# EAGLE schematic headstage (EAGLE 6.6.0)
DESIGNER: JONNEW, MWL@MIT; DESIGN_NAME: headstage (2x64_hirose-circular); LICENSE: (c) Jon Newman CC-BY-SA-NC 4.0; REVISION: 1.1
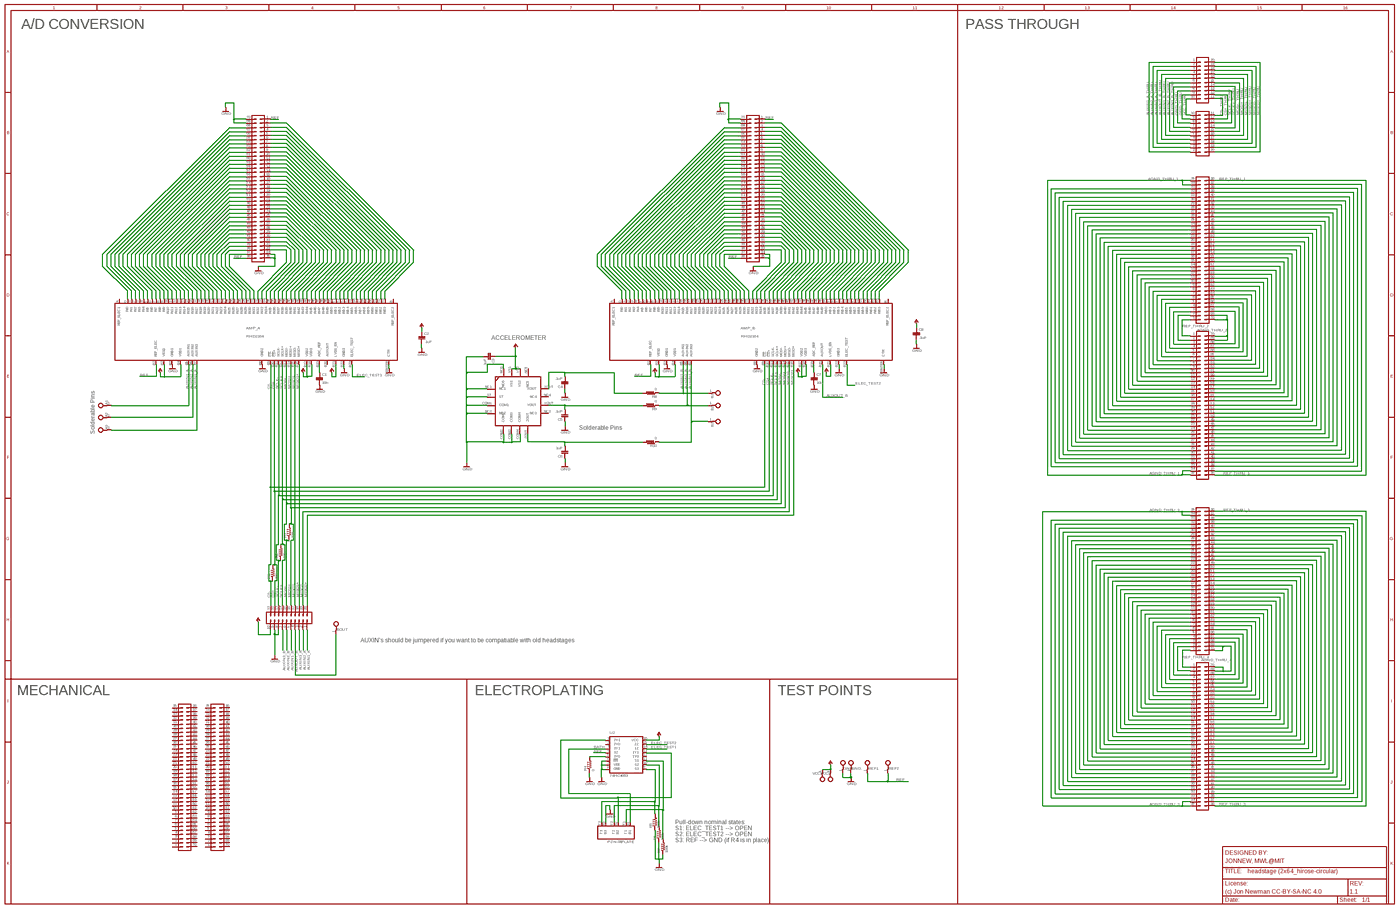
[diagram p0: schematic, sheet 1, overview]
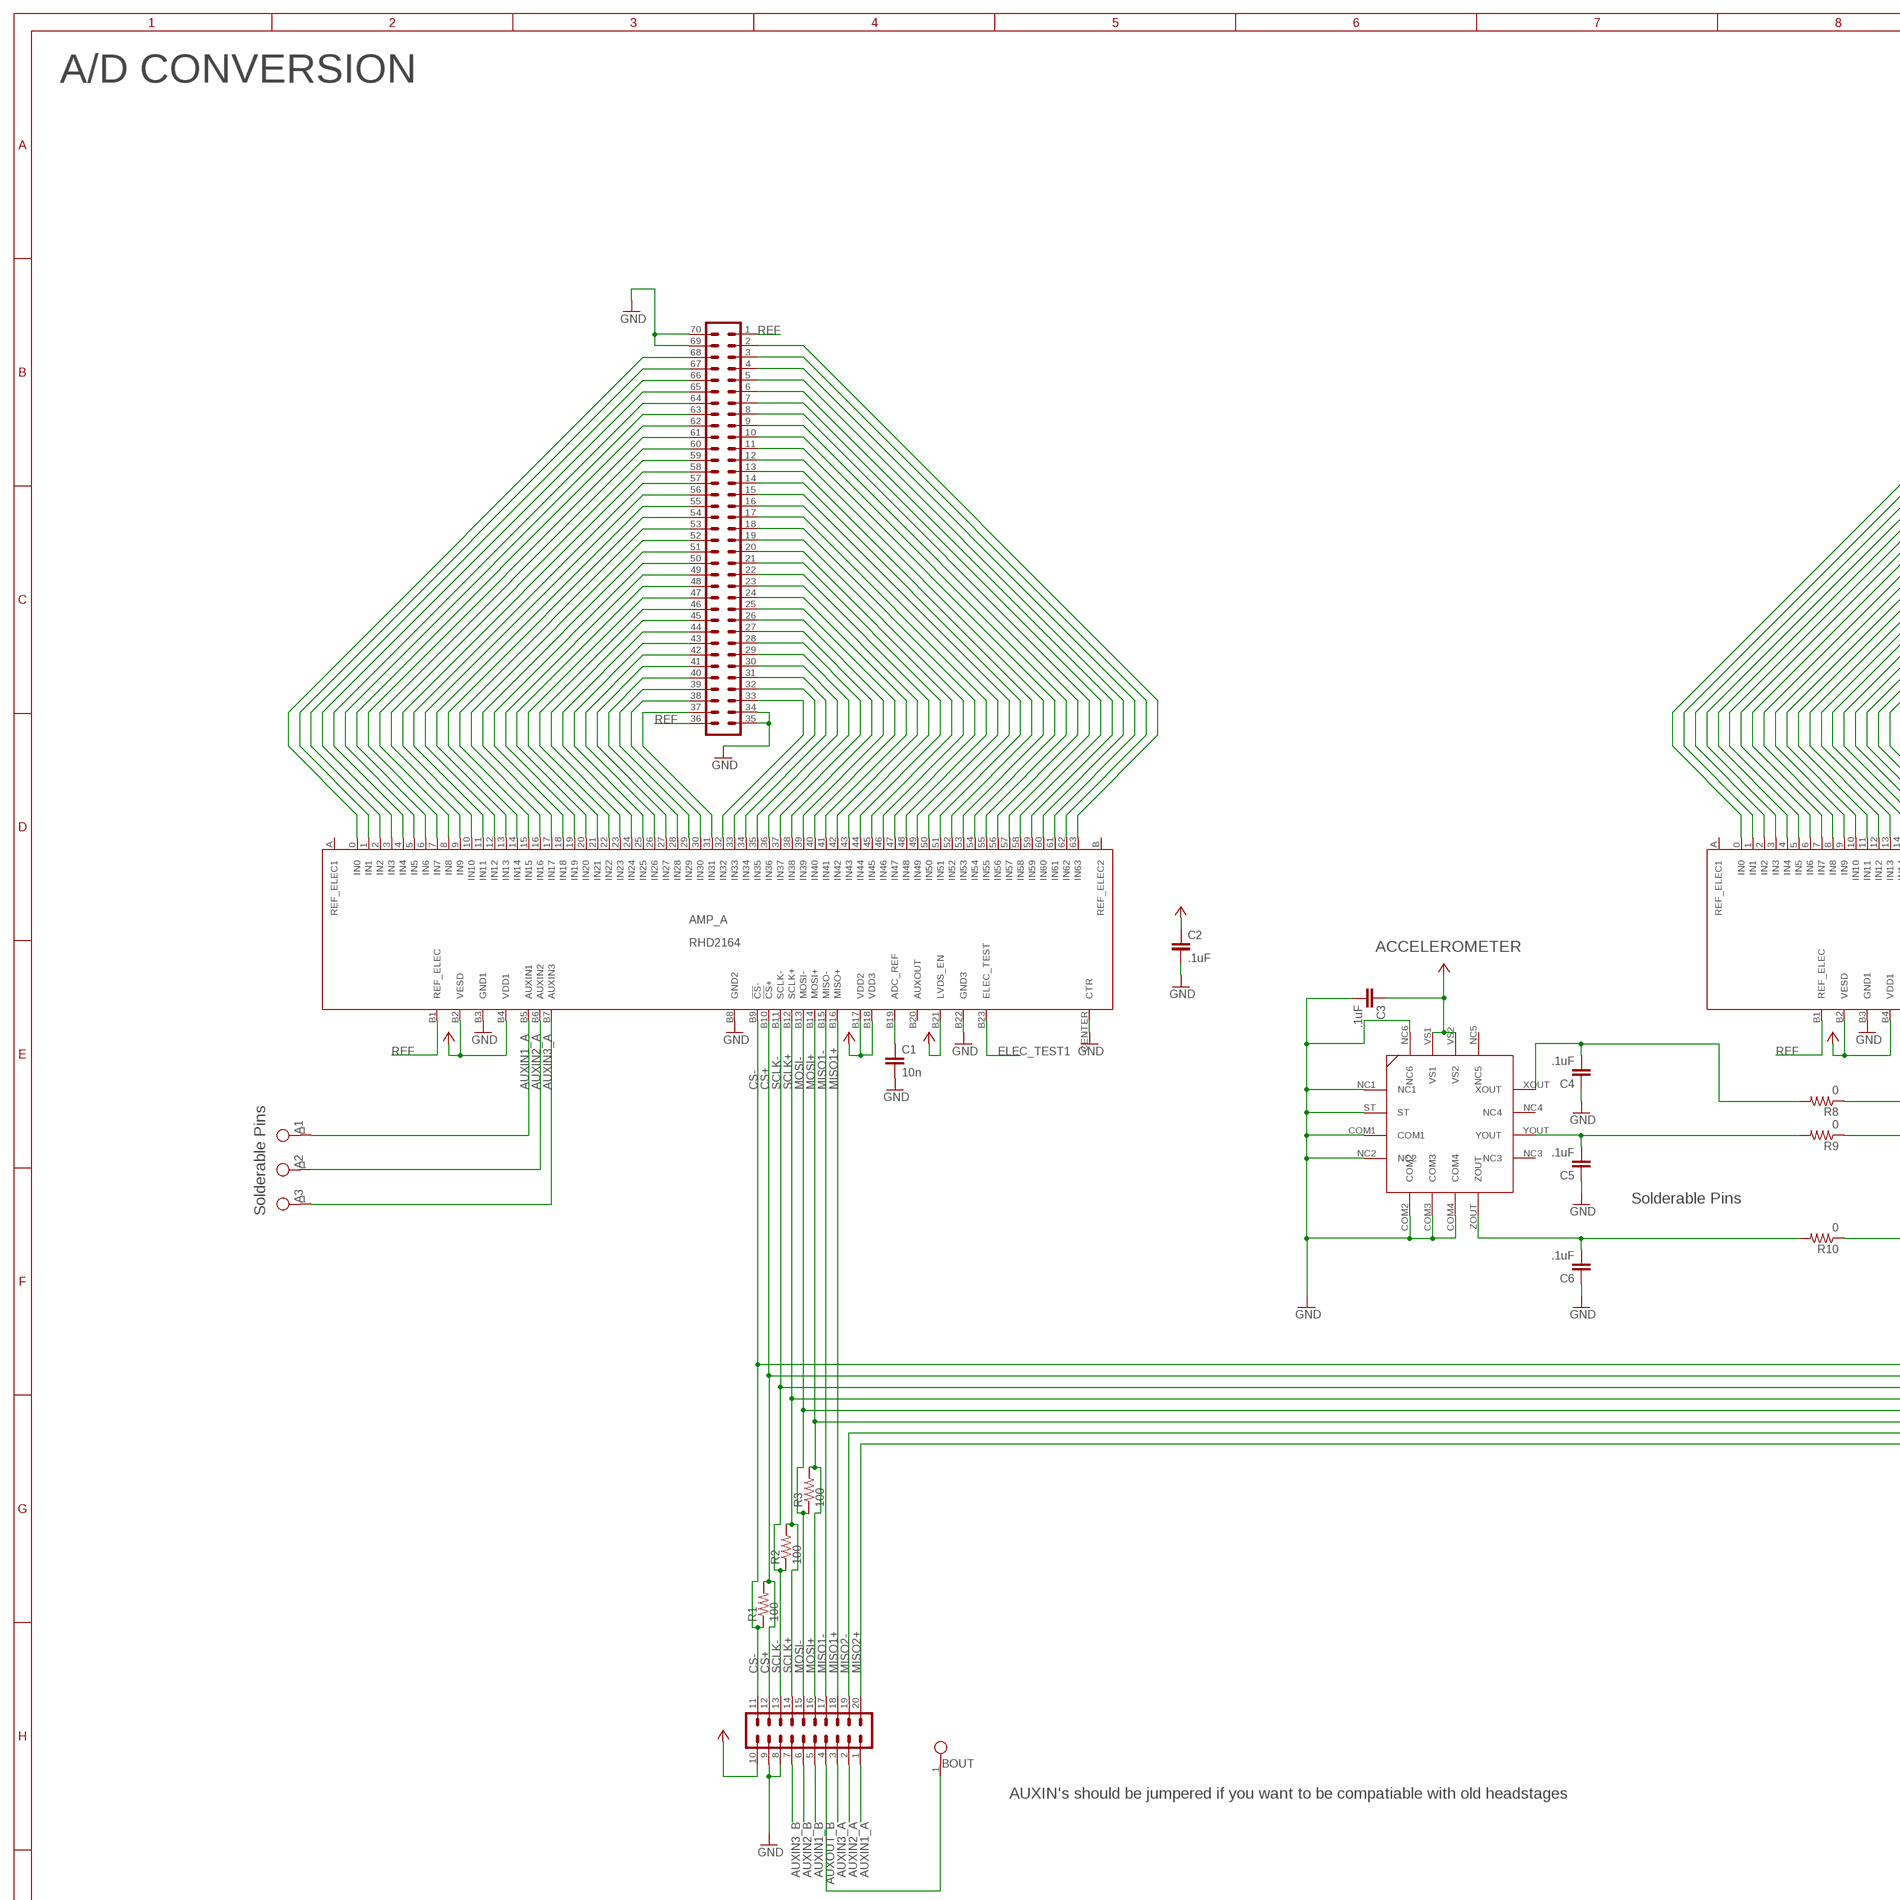
[diagram p1: schematic, sheet 1, part 1 of 4]
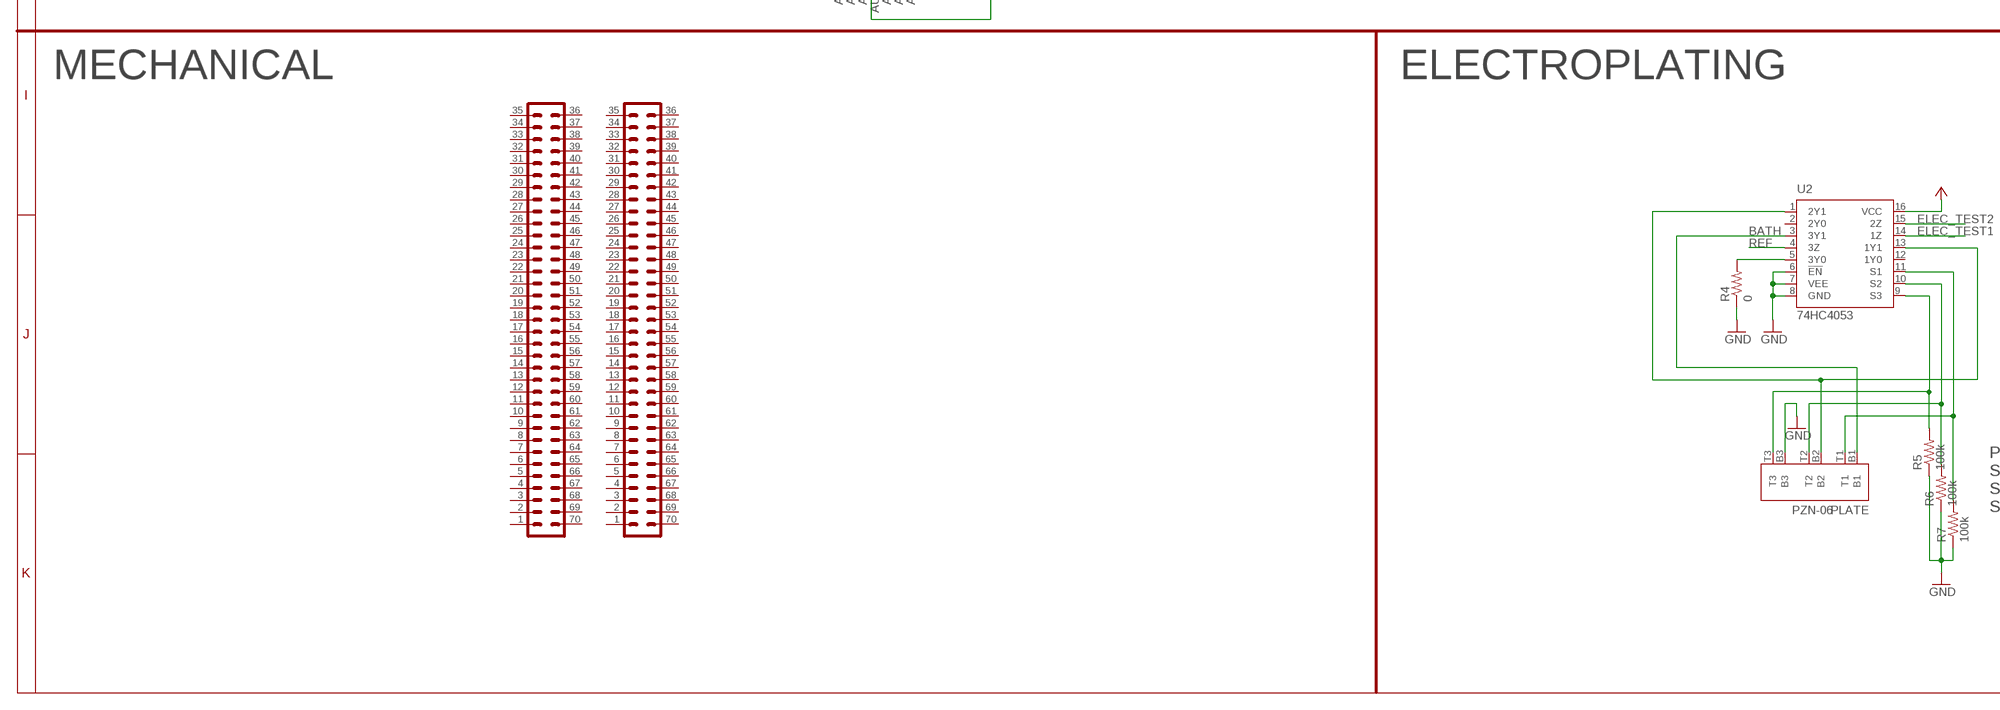
[diagram p2: schematic, sheet 1, part 2 of 4]
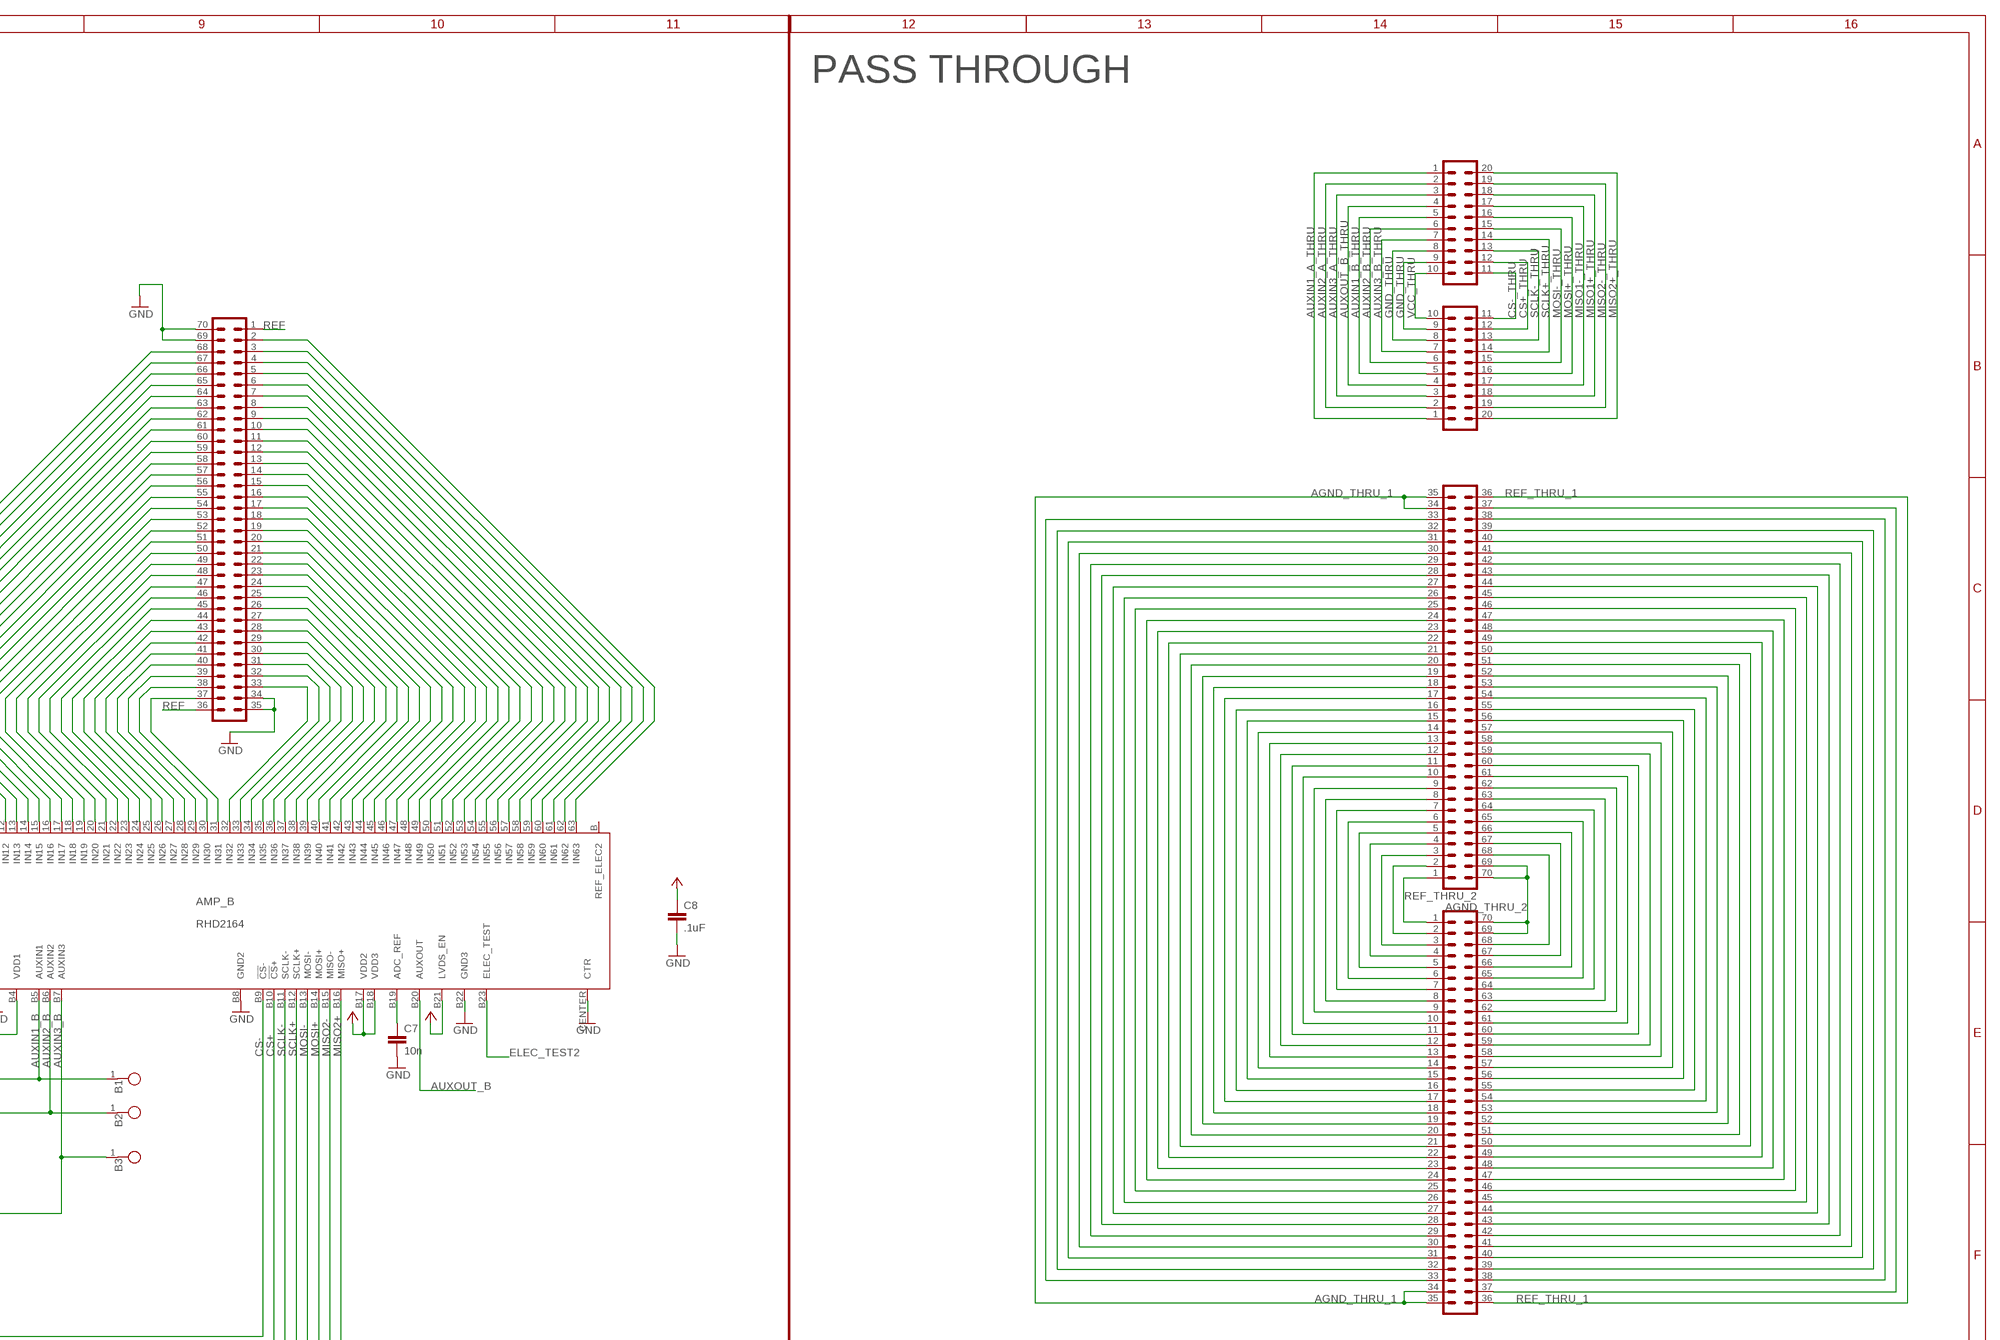
[diagram p3: schematic, sheet 1, part 3 of 4]
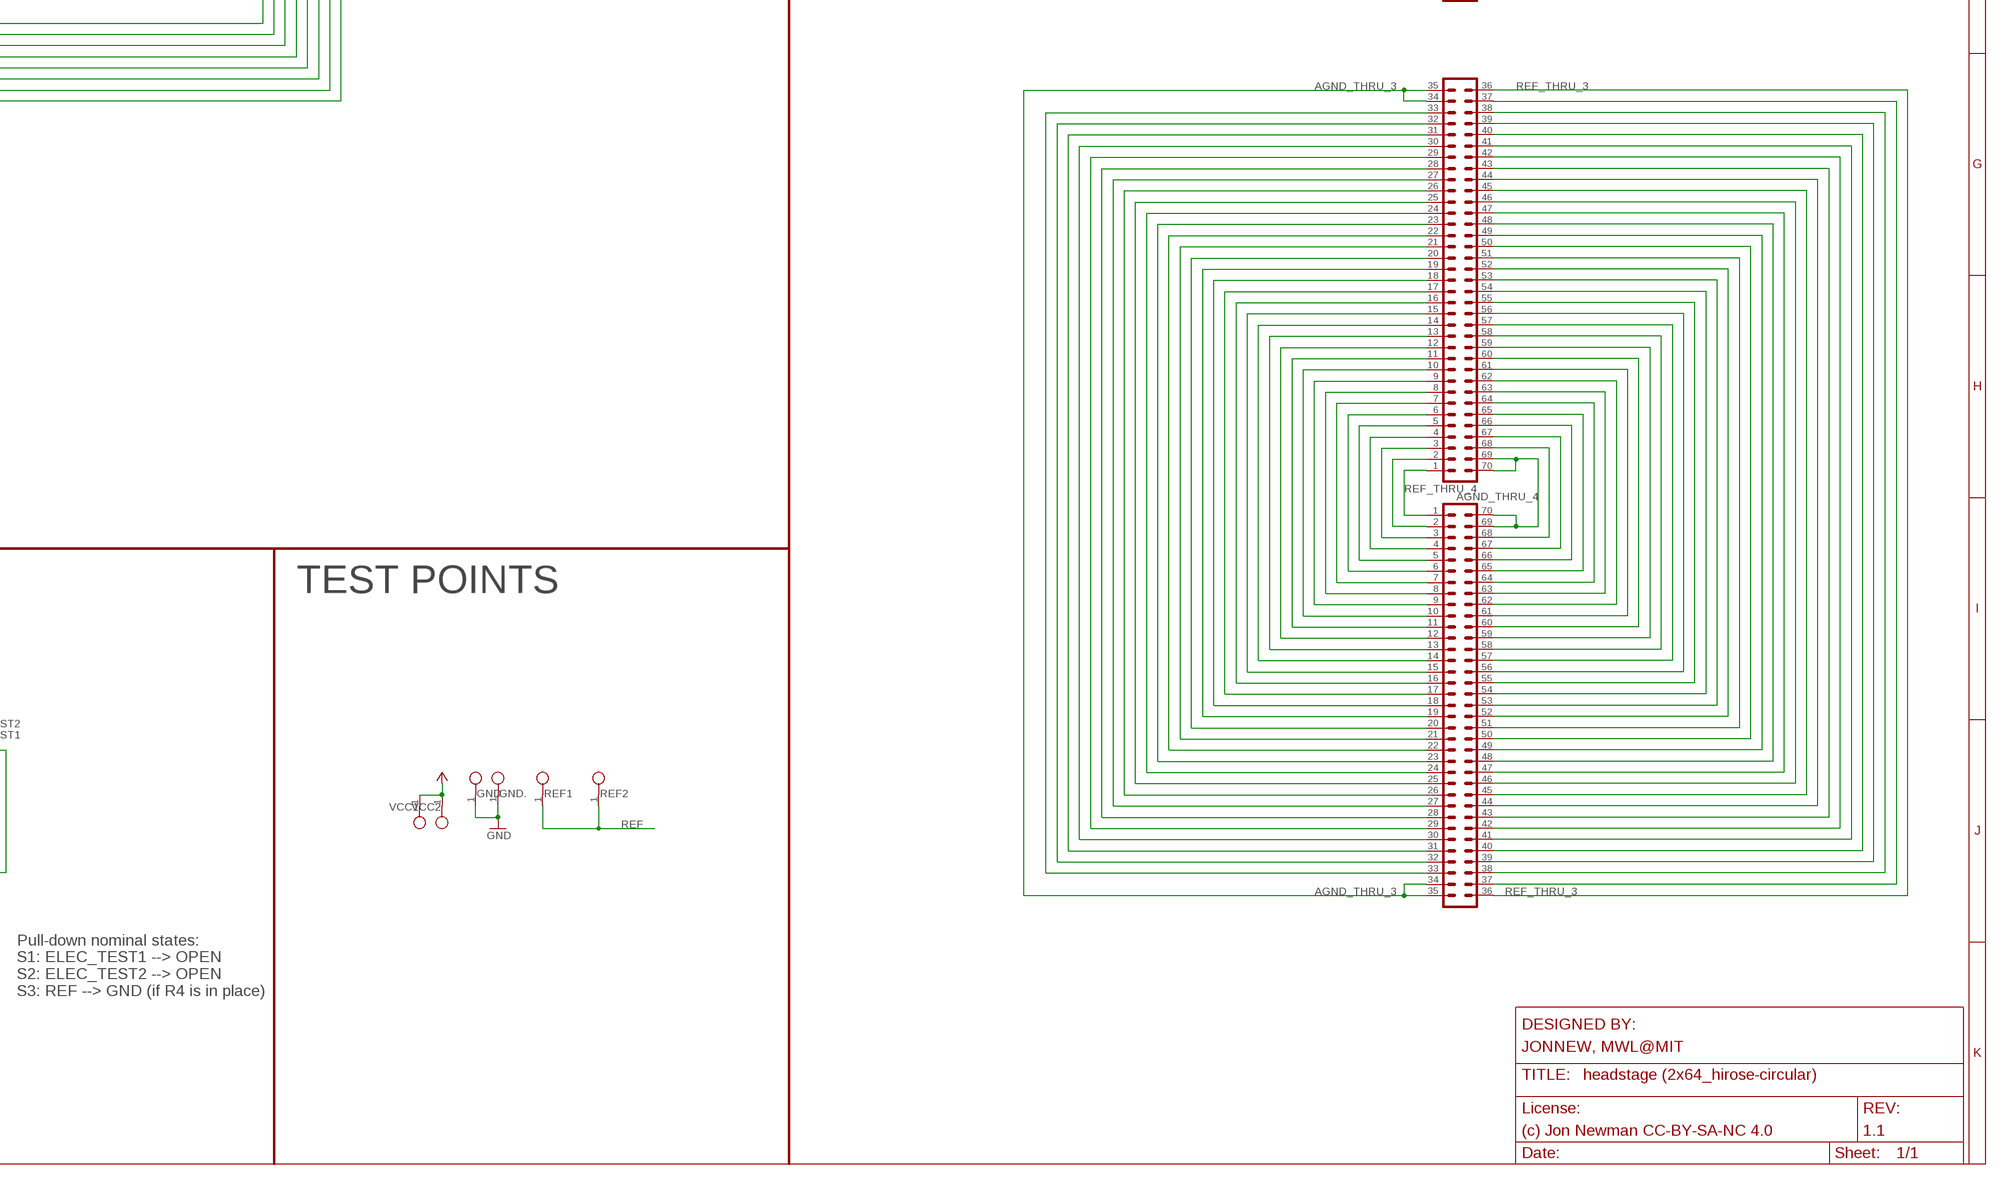
[diagram p4: schematic, sheet 1, part 4 of 4]

## Parts
A1  TESTPOINT_SMALL  [TESTPOINT_SMALL]
A2  TESTPOINT_SMALL  [TESTPOINT_SMALL]
A3  TESTPOINT_SMALL  [TESTPOINT_SMALL]
AIN_BNB  DF40REC  PINHD-2X35_DF40REC  [DF40-70REC]
AIN_BSB  DF40REC  PINHD-2X35_DF40REC  [DF40-70REC]
AMP_A  RHD2164  RHD2164_COB  [RHD2164_COB]
AMP_B  RHD2164  RHD2164_COB  [RHD2164_COB]
ATHRU_BEB  DF40REC  PINHD-2X35_DF40REC  [DF40-70REC]
ATHRU_BWB  DF40REC  PINHD-2X35_DF40REC  [DF40-70REC]
ATHRU_TEB  DF40HEAD  PINHD-2X35_DF40HEAD  [DF40-70HEAD]
ATHRU_TWB  DF40HEAD  PINHD-2X35_DF40HEAD  [DF40-70HEAD]
B1  TESTPOINT_SMALL  [TESTPOINT_SMALL]
B2  TESTPOINT_SMALL  [TESTPOINT_SMALL]
B3  TESTPOINT_SMALL  [TESTPOINT_SMALL]
BOUT  TESTPOINT_SMALL  [TESTPOINT_SMALL]
C1  10n  C_0201  [0201]
C2  .1uF  C_0402  [0402]
C3  .1uF  C_0402  [0402]
C4  .1uF  C_0402  [0402]
C5  .1uF  C_0402  [0402]
C6  .1uF  C_0402  [0402]
C7  10n  C_0201  [0201]
C8  .1uF  C_0402  [0402]
DIO_TEA  DF40HEAD  PINHD-2X10_DF40-20HEAD  [DF40-20HEAD]
DTHRU_BNA  DF40REC  PINHD-2X10_DF40-20REC  [DF40-20REC]
DTHRU_TNA  DF40HEAD  PINHD-2X10_DF40-20HEAD  [DF40-20HEAD]
GND  GND  TESTPOINT_SMALL  [TESTPOINT_SMALL]
GND.  GND  TESTPOINT_SMALL  [TESTPOINT_SMALL]
MECH_TNB  DF40HEAD  PINHD-2X35_DF40HEAD  [DF40-70HEAD]
MECH_TSB  DF40HEAD  PINHD-2X35_DF40HEAD  [DF40-70HEAD]
PLATE  PZN-06  OMNETICS_PZN-06_SMD  [OMNETICS_PZN-06-AA]
R1  100  R_0201  [0201]
R2  100  R_0201  [0201]
R3  100  R_0201  [0201]
R4  0  R_0402  [0402]
R5  100k  R_0201  [0201]
R6  100k  R_0201  [0201]
R7  100k  R_0201  [0201]
R8  0  R_0201  [0201]
R9  0  R_0201  [0201]
R10  0  R_0201  [0201]
REF1  REF  TESTPOINT_SMALL  [TESTPOINT_SMALL]
REF2  REF  TESTPOINT_SMALL  [TESTPOINT_SMALL]
U1  ADXL335  [ADXL335]
U2  74HC4053  74HC4053_TSSOP-16  [TSSOP-16]
VCC1  VCC  TESTPOINT_SMALL  [TESTPOINT_SMALL]
VCC2  VCC  TESTPOINT_SMALL  [TESTPOINT_SMALL]

## Nets
AGND_THRU_1: ATHRU_BWB.34 ATHRU_BWB.35 ATHRU_TWB.34 ATHRU_TWB.35
AGND_THRU_2: ATHRU_BWB.69 ATHRU_BWB.70 ATHRU_TWB.69 ATHRU_TWB.70
AGND_THRU_3 [thick]: ATHRU_BEB.34 ATHRU_BEB.35 ATHRU_TEB.34 ATHRU_TEB.35
AGND_THRU_4: ATHRU_BEB.69 ATHRU_BEB.70 ATHRU_TEB.69 ATHRU_TEB.70
AUXIN1_A: A1.1 AMP_A.B5(AUXIN1) DIO_TEA.1
AUXIN1_A_THRU: DTHRU_BNA.1 DTHRU_TNA.1
AUXIN1_B: AMP_B.B5(AUXIN1) B1.1 DIO_TEA.5 R8.1
AUXIN1_B_THRU: DTHRU_BNA.5 DTHRU_TNA.5
AUXIN2_A: A2.1 AMP_A.B6(AUXIN2) DIO_TEA.2
AUXIN2_A_THRU: DTHRU_BNA.2 DTHRU_TNA.2
AUXIN2_B: AMP_B.B6(AUXIN2) B2.1 DIO_TEA.6 R9.1
AUXIN2_B_THRU: DTHRU_BNA.6 DTHRU_TNA.6
AUXIN3_A: A3.1 AMP_A.B7(AUXIN3) DIO_TEA.3
AUXIN3_A_THRU: DTHRU_BNA.3 DTHRU_TNA.3
AUXIN3_B: AMP_B.B7(AUXIN3) B3.1 DIO_TEA.7 R10.1
AUXIN3_B_THRU: DTHRU_BNA.7 DTHRU_TNA.7
AUXOUT_B: AMP_B.B20(AUXOUT) BOUT.1 DIO_TEA.4
AUXOUT_B_THRU: DTHRU_BNA.4 DTHRU_TNA.4
BATH [thick]: PLATE.B1 U2.3(3Y1)
CS+: AMP_A.B10(!CS!+) AMP_B.B10(!CS!+) DIO_TEA.12 R1.2
CS+_THRU: DTHRU_BNA.12 DTHRU_TNA.12
CS-: AMP_A.B9(!CS!-) AMP_B.B9(!CS!-) DIO_TEA.11 R1.1
CS-_THRU: DTHRU_BNA.11 DTHRU_TNA.11
ELEC_TEST1: AMP_A.B23(ELEC_TEST) U2.14(1Z)
ELEC_TEST2: AMP_B.B23(ELEC_TEST) U2.15(2Z)
GND [thick]: AIN_BNB.34 AIN_BNB.35 AIN_BNB.69 AIN_BNB.70 AIN_BSB.34 AIN_BSB.35 AIN_BSB.69 AIN_BSB.70 AMP_A.B3(GND1) AMP_A.B8(GND2) AMP_A.B22(GND3) AMP_A.CENTER(CTR) AMP_B.B3(GND1) AMP_B.B8(GND2) AMP_B.B22(GND3) AMP_B.CENTER(CTR) C1.2 C2.2 C3.2 C4.1 C5.1 C6.1 C7.2 C8.2 DIO_TEA.8 DIO_TEA.9 GND.1 GND..1 PLATE.B3 R4.1 R5.1 R6.1 R7.1 U1.COM1 U1.COM2 U1.COM3 U1.COM4 U1.NC1 U1.NC2 U1.NC6 U1.ST U2.6(!EN!) U2.7(VEE) U2.8(GND)
GND_THRU: DTHRU_BNA.8 DTHRU_BNA.9 DTHRU_TNA.8 DTHRU_TNA.9
MISO1+: AMP_A.B16(MISO+) DIO_TEA.18
MISO1+_THRU: DTHRU_BNA.18 DTHRU_TNA.18
MISO1-: AMP_A.B15(MISO-) DIO_TEA.17
MISO1-_THRU: DTHRU_BNA.17 DTHRU_TNA.17
MISO2+: AMP_B.B16(MISO+) DIO_TEA.20
MISO2+_THRU: DTHRU_BNA.20 DTHRU_TNA.20
MISO2-: AMP_B.B15(MISO-) DIO_TEA.19
MISO2-_THRU: DTHRU_BNA.19 DTHRU_TNA.19
MOSI+: AMP_A.B14(MOSI+) AMP_B.B14(MOSI+) DIO_TEA.16 R3.2
MOSI+_THRU: DTHRU_BNA.16 DTHRU_TNA.16
MOSI-: AMP_A.B13(MOSI-) AMP_B.B13(MOSI-) DIO_TEA.15 R3.1
MOSI-_THRU: DTHRU_BNA.15 DTHRU_TNA.15
N$1 [thick]: AMP_B.B19(ADC_REF) C7.1
N$2: AIN_BNB.38 AMP_A.30(IN30)
N$3: AIN_BNB.39 AMP_A.29(IN29)
N$4: AIN_BNB.40 AMP_A.28(IN28)
N$5: AIN_BNB.41 AMP_A.27(IN27)
N$6: AIN_BNB.42 AMP_A.26(IN26)
N$7: AIN_BNB.32 AMP_A.33(IN33)
N$8: AIN_BNB.31 AMP_A.34(IN34)
N$9: AIN_BNB.30 AMP_A.35(IN35)
N$10: AIN_BNB.29 AMP_A.36(IN36)
N$11: AIN_BSB.38 AMP_B.30(IN30)
N$12: AIN_BNB.28 AMP_A.37(IN37)
N$13: AIN_BNB.27 AMP_A.38(IN38)
N$14: AIN_BNB.26 AMP_A.39(IN39)
N$15: AIN_BNB.25 AMP_A.40(IN40)
N$16: AIN_BNB.24 AMP_A.41(IN41)
N$17: AIN_BNB.23 AMP_A.42(IN42)
N$18: AIN_BNB.22 AMP_A.43(IN43)
N$19: AIN_BNB.21 AMP_A.44(IN44)
N$20: AIN_BNB.20 AMP_A.45(IN45)
N$21: AIN_BNB.19 AMP_A.46(IN46)
N$22: AIN_BNB.18 AMP_A.47(IN47)
N$23: AIN_BNB.17 AMP_A.48(IN48)
N$24: AIN_BNB.16 AMP_A.49(IN49)
N$25: AIN_BNB.15 AMP_A.50(IN50)
N$26: AIN_BNB.14 AMP_A.51(IN51)
N$27: AIN_BNB.13 AMP_A.52(IN52)
N$28: AIN_BNB.12 AMP_A.53(IN53)
N$29: AIN_BNB.11 AMP_A.54(IN54)
N$30: AIN_BNB.10 AMP_A.55(IN55)
N$31: AIN_BNB.9 AMP_A.56(IN56)
N$32: AIN_BNB.8 AMP_A.57(IN57)
N$33: AIN_BNB.7 AMP_A.58(IN58)
N$34: AIN_BNB.6 AMP_A.59(IN59)
N$35: AIN_BSB.39 AMP_B.29(IN29)
N$36: AIN_BSB.40 AMP_B.28(IN28)
N$37: AIN_BSB.41 AMP_B.27(IN27)
N$38: AIN_BSB.42 AMP_B.26(IN26)
N$39: AIN_BSB.43 AMP_B.25(IN25)
N$40: AIN_BSB.44 AMP_B.24(IN24)
N$41: AIN_BNB.5 AMP_A.60(IN60)
N$42 [thick]: AMP_A.B19(ADC_REF) C1.1
N$43: AIN_BNB.4 AMP_A.61(IN61)
N$44: AIN_BNB.3 AMP_A.62(IN62)
N$45: AIN_BNB.2 AMP_A.63(IN63)
N$46: AIN_BNB.33 AMP_A.32(IN32)
N$47: AIN_BSB.45 AMP_B.23(IN23)
N$48: AIN_BSB.46 AMP_B.22(IN22)
N$49: AIN_BSB.47 AMP_B.21(IN21)
N$50: AIN_BSB.48 AMP_B.20(IN20)
N$51: AIN_BSB.49 AMP_B.19(IN19)
N$52: AIN_BSB.50 AMP_B.18(IN18)
N$53: AIN_BSB.51 AMP_B.17(IN17)
N$54: AIN_BSB.52 AMP_B.16(IN16)
N$55: AIN_BSB.53 AMP_B.15(IN15)
N$56: AIN_BSB.54 AMP_B.14(IN14)
N$57: AIN_BSB.55 AMP_B.13(IN13)
N$58: AIN_BSB.56 AMP_B.12(IN12)
N$59: AIN_BSB.57 AMP_B.11(IN11)
N$60: AIN_BSB.58 AMP_B.10(IN10)
N$61: AIN_BSB.59 AMP_B.9(IN9)
N$62: AIN_BSB.60 AMP_B.8(IN8)
N$63: AIN_BSB.61 AMP_B.7(IN7)
N$64: AIN_BSB.62 AMP_B.6(IN6)
N$65: AIN_BSB.63 AMP_B.5(IN5)
N$66: AIN_BSB.64 AMP_B.4(IN4)
N$67: AIN_BSB.65 AMP_B.3(IN3)
N$68: AIN_BSB.66 AMP_B.2(IN2)
N$69: AIN_BSB.67 AMP_B.1(IN1)
N$70: AIN_BNB.43 AMP_A.25(IN25)
N$71: AIN_BNB.44 AMP_A.24(IN24)
N$72: AIN_BNB.45 AMP_A.23(IN23)
N$73: AIN_BNB.46 AMP_A.22(IN22)
N$74: AIN_BSB.68 AMP_B.0(IN0)
N$75: AIN_BSB.37 AMP_B.31(IN31)
N$76: AIN_BSB.32 AMP_B.33(IN33)
N$77: AIN_BSB.31 AMP_B.34(IN34)
N$78: AIN_BSB.30 AMP_B.35(IN35)
N$79: AIN_BSB.29 AMP_B.36(IN36)
N$80: AIN_BSB.28 AMP_B.37(IN37)
N$81: AIN_BSB.27 AMP_B.38(IN38)
N$82: AIN_BSB.26 AMP_B.39(IN39)
N$83: AIN_BSB.25 AMP_B.40(IN40)
N$84: AIN_BSB.24 AMP_B.41(IN41)
N$85: AIN_BSB.23 AMP_B.42(IN42)
N$86: AIN_BSB.22 AMP_B.43(IN43)
N$87: AIN_BSB.21 AMP_B.44(IN44)
N$88: AIN_BSB.20 AMP_B.45(IN45)
N$89: AIN_BSB.19 AMP_B.46(IN46)
N$90: AIN_BSB.18 AMP_B.47(IN47)
N$91: AIN_BSB.17 AMP_B.48(IN48)
N$92: AIN_BSB.16 AMP_B.49(IN49)
N$93: AIN_BSB.15 AMP_B.50(IN50)
N$94: AIN_BSB.14 AMP_B.51(IN51)
N$95: AIN_BSB.13 AMP_B.52(IN52)
N$96: AIN_BSB.12 AMP_B.53(IN53)
N$97: AIN_BSB.11 AMP_B.54(IN54)
N$98: AIN_BSB.10 AMP_B.55(IN55)
N$99: AIN_BSB.9 AMP_B.56(IN56)
N$100: AIN_BSB.8 AMP_B.57(IN57)
N$101: AIN_BSB.7 AMP_B.58(IN58)
N$102: AIN_BSB.6 AMP_B.59(IN59)
N$103: AIN_BSB.5 AMP_B.60(IN60)
N$104: AIN_BSB.4 AMP_B.61(IN61)
N$105: AIN_BSB.3 AMP_B.62(IN62)
N$106: AIN_BSB.2 AMP_B.63(IN63)
N$107: AIN_BSB.33 AMP_B.32(IN32)
N$108: ATHRU_BEB.33 ATHRU_TEB.33
N$109: ATHRU_BEB.32 ATHRU_TEB.32
N$110: ATHRU_BEB.31 ATHRU_TEB.31
N$111: ATHRU_BEB.30 ATHRU_TEB.30
N$112: ATHRU_BEB.29 ATHRU_TEB.29
N$113: ATHRU_BEB.28 ATHRU_TEB.28
N$114: ATHRU_BEB.27 ATHRU_TEB.27
N$115: ATHRU_BEB.26 ATHRU_TEB.26
N$116: ATHRU_BEB.25 ATHRU_TEB.25
N$117: ATHRU_BEB.24 ATHRU_TEB.24
N$118: ATHRU_BEB.23 ATHRU_TEB.23
N$119: ATHRU_BEB.22 ATHRU_TEB.22
N$120: ATHRU_BEB.21 ATHRU_TEB.21
N$121: ATHRU_BEB.20 ATHRU_TEB.20
N$122: ATHRU_BEB.19 ATHRU_TEB.19
N$123: ATHRU_BEB.18 ATHRU_TEB.18
N$124: ATHRU_BEB.17 ATHRU_TEB.17
N$125: ATHRU_BEB.16 ATHRU_TEB.16
N$126: ATHRU_BEB.15 ATHRU_TEB.15
N$127: ATHRU_BEB.14 ATHRU_TEB.14
N$128: ATHRU_BEB.13 ATHRU_TEB.13
N$129: ATHRU_BEB.12 ATHRU_TEB.12
N$130: ATHRU_BEB.11 ATHRU_TEB.11
N$131: PLATE.T1 R7.2 U2.11(S1)
N$132: PLATE.T2 R6.2 U2.10(S2)
N$133: PLATE.T3 R5.2 U2.9(S3)
N$134 [thick]: R4.2 U2.5(3Y0)
N$136: PLATE.B2 U2.1(2Y1) U2.13(1Y1)
N$137: AIN_BNB.47 AMP_A.21(IN21)
N$138: AIN_BNB.48 AMP_A.20(IN20)
N$139: AIN_BNB.49 AMP_A.19(IN19)
N$140: AIN_BNB.50 AMP_A.18(IN18)
N$141: AIN_BNB.51 AMP_A.17(IN17)
N$142: AIN_BNB.52 AMP_A.16(IN16)
N$143: AIN_BNB.53 AMP_A.15(IN15)
N$144: AIN_BNB.54 AMP_A.14(IN14)
N$145: AIN_BNB.55 AMP_A.13(IN13)
N$146: AIN_BNB.56 AMP_A.12(IN12)
N$147: AIN_BNB.57 AMP_A.11(IN11)
N$148: AIN_BNB.58 AMP_A.10(IN10)
N$149: AIN_BNB.59 AMP_A.9(IN9)
N$150: AIN_BNB.60 AMP_A.8(IN8)
N$151: AIN_BNB.61 AMP_A.7(IN7)
N$152: AIN_BNB.62 AMP_A.6(IN6)
N$153: AIN_BNB.63 AMP_A.5(IN5)
N$154: AIN_BNB.64 AMP_A.4(IN4)
N$155: AIN_BNB.65 AMP_A.3(IN3)
N$156: AIN_BNB.66 AMP_A.2(IN2)
N$157: ATHRU_BEB.10 ATHRU_TEB.10
N$158: ATHRU_BEB.9 ATHRU_TEB.9
N$159: ATHRU_BEB.8 ATHRU_TEB.8
N$160: ATHRU_BEB.7 ATHRU_TEB.7
N$161: ATHRU_BEB.6 ATHRU_TEB.6
N$162: AIN_BNB.37 AMP_A.31(IN31)
N$163: ATHRU_BEB.5 ATHRU_TEB.5
N$164: ATHRU_BEB.4 ATHRU_TEB.4
N$165: ATHRU_BEB.3 ATHRU_TEB.3
N$166: ATHRU_BEB.2 ATHRU_TEB.2
N$167: ATHRU_BEB.38 ATHRU_TEB.38
N$168: ATHRU_BEB.39 ATHRU_TEB.39
N$169: ATHRU_BEB.40 ATHRU_TEB.40
N$170: ATHRU_BEB.41 ATHRU_TEB.41
N$171: ATHRU_BEB.42 ATHRU_TEB.42
N$172: ATHRU_BEB.43 ATHRU_TEB.43
N$173: ATHRU_BEB.44 ATHRU_TEB.44
N$174: ATHRU_BEB.45 ATHRU_TEB.45
N$175: ATHRU_BEB.46 ATHRU_TEB.46
N$176: ATHRU_BEB.47 ATHRU_TEB.47
N$177: ATHRU_BEB.48 ATHRU_TEB.48
N$178: ATHRU_BEB.49 ATHRU_TEB.49
N$179: ATHRU_BEB.50 ATHRU_TEB.50
N$180: ATHRU_BEB.51 ATHRU_TEB.51
N$181: ATHRU_BEB.52 ATHRU_TEB.52
N$182: ATHRU_BEB.53 ATHRU_TEB.53
N$183: ATHRU_BEB.54 ATHRU_TEB.54
N$184: ATHRU_BEB.55 ATHRU_TEB.55
N$185: ATHRU_BEB.56 ATHRU_TEB.56
N$186: ATHRU_BEB.57 ATHRU_TEB.57
N$187: ATHRU_BEB.58 ATHRU_TEB.58
N$188: ATHRU_BEB.59 ATHRU_TEB.59
N$189: ATHRU_BEB.60 ATHRU_TEB.60
N$190: ATHRU_BEB.61 ATHRU_TEB.61
N$191: ATHRU_BEB.62 ATHRU_TEB.62
N$192: ATHRU_BEB.63 ATHRU_TEB.63
N$193: ATHRU_BEB.64 ATHRU_TEB.64
N$194: ATHRU_BEB.65 ATHRU_TEB.65
N$195: ATHRU_BEB.66 ATHRU_TEB.66
N$196: ATHRU_BEB.67 ATHRU_TEB.67
N$197: ATHRU_BEB.68 ATHRU_TEB.68
N$199: ATHRU_BWB.33 ATHRU_TWB.33
N$200: ATHRU_BWB.32 ATHRU_TWB.32
N$201: ATHRU_BWB.31 ATHRU_TWB.31
N$202: ATHRU_BWB.30 ATHRU_TWB.30
N$203: ATHRU_BWB.29 ATHRU_TWB.29
N$204: ATHRU_BWB.28 ATHRU_TWB.28
N$205: ATHRU_BWB.27 ATHRU_TWB.27
N$206: ATHRU_BWB.26 ATHRU_TWB.26
N$207: ATHRU_BWB.25 ATHRU_TWB.25
N$208: ATHRU_BWB.24 ATHRU_TWB.24
N$209: ATHRU_BWB.23 ATHRU_TWB.23
N$210: ATHRU_BWB.22 ATHRU_TWB.22
N$211: ATHRU_BWB.21 ATHRU_TWB.21
N$212: ATHRU_BWB.20 ATHRU_TWB.20
N$213: ATHRU_BWB.19 ATHRU_TWB.19
N$214: ATHRU_BWB.18 ATHRU_TWB.18
N$215: ATHRU_BWB.17 ATHRU_TWB.17
N$216: ATHRU_BWB.16 ATHRU_TWB.16
N$217: ATHRU_BWB.15 ATHRU_TWB.15
N$218: ATHRU_BWB.14 ATHRU_TWB.14
N$219: ATHRU_BWB.13 ATHRU_TWB.13
N$220: ATHRU_BWB.12 ATHRU_TWB.12
N$221: ATHRU_BWB.11 ATHRU_TWB.11
N$222: ATHRU_BWB.10 ATHRU_TWB.10
N$223: ATHRU_BWB.9 ATHRU_TWB.9
N$224: ATHRU_BWB.8 ATHRU_TWB.8
N$225: ATHRU_BWB.7 ATHRU_TWB.7
N$226: ATHRU_BWB.6 ATHRU_TWB.6
N$227: ATHRU_BWB.5 ATHRU_TWB.5
N$228: ATHRU_BWB.4 ATHRU_TWB.4
N$229: ATHRU_BWB.3 ATHRU_TWB.3
N$230: ATHRU_BWB.2 ATHRU_TWB.2
N$231: ATHRU_BWB.38 ATHRU_TWB.38
N$232: ATHRU_BWB.39 ATHRU_TWB.39
N$233: ATHRU_BWB.40 ATHRU_TWB.40
N$234: ATHRU_BWB.41 ATHRU_TWB.41
N$235: ATHRU_BWB.42 ATHRU_TWB.42
N$236: ATHRU_BWB.43 ATHRU_TWB.43
N$237: ATHRU_BWB.44 ATHRU_TWB.44
N$238: ATHRU_BWB.45 ATHRU_TWB.45
N$239: ATHRU_BWB.46 ATHRU_TWB.46
N$240: ATHRU_BWB.47 ATHRU_TWB.47
N$241: ATHRU_BWB.48 ATHRU_TWB.48
N$242: ATHRU_BWB.49 ATHRU_TWB.49
N$243: ATHRU_BWB.50 ATHRU_TWB.50
N$244: ATHRU_BWB.51 ATHRU_TWB.51
N$245: ATHRU_BWB.52 ATHRU_TWB.52
N$246: ATHRU_BWB.53 ATHRU_TWB.53
N$247: ATHRU_BWB.54 ATHRU_TWB.54
N$248: ATHRU_BWB.55 ATHRU_TWB.55
N$249: ATHRU_BWB.56 ATHRU_TWB.56
N$250: ATHRU_BWB.57 ATHRU_TWB.57
N$251: ATHRU_BWB.58 ATHRU_TWB.58
N$252: ATHRU_BWB.59 ATHRU_TWB.59
N$253: ATHRU_BWB.60 ATHRU_TWB.60
N$254: ATHRU_BWB.61 ATHRU_TWB.61
N$255: ATHRU_BWB.62 ATHRU_TWB.62
N$256: ATHRU_BWB.63 ATHRU_TWB.63
N$257: ATHRU_BWB.64 ATHRU_TWB.64
N$258: ATHRU_BWB.65 ATHRU_TWB.65
N$259: ATHRU_BWB.66 ATHRU_TWB.66
N$260: ATHRU_BWB.67 ATHRU_TWB.67
N$261: ATHRU_BWB.68 ATHRU_TWB.68
N$262: ATHRU_BEB.37 ATHRU_TEB.37
N$450: AIN_BNB.68 AMP_A.0(IN0)
N$451: AIN_BNB.67 AMP_A.1(IN1)
N$1000: ATHRU_BWB.37 ATHRU_TWB.37
REF: AIN_BNB.1 AIN_BNB.36 AIN_BSB.1 AIN_BSB.36 AMP_A.B1(REF_ELEC) AMP_B.B1(REF_ELEC) REF1.1 REF2.1 U2.4(3Z)
REF_THRU_1: ATHRU_BWB.36 ATHRU_TWB.36
REF_THRU_2: ATHRU_BWB.1 ATHRU_TWB.1
REF_THRU_3: ATHRU_BEB.36 ATHRU_TEB.36
REF_THRU_4: ATHRU_BEB.1 ATHRU_TEB.1
SCLK+: AMP_A.B12(SCLK+) AMP_B.B12(SCLK+) DIO_TEA.14 R2.2
SCLK+_THRU: DTHRU_BNA.14 DTHRU_TNA.14
SCLK-: AMP_A.B11(SCLK-) AMP_B.B11(SCLK-) DIO_TEA.13 R2.1
SCLK-_THRU: DTHRU_BNA.13 DTHRU_TNA.13
VCC [thick]: AMP_A.B2(VESD) AMP_A.B4(VDD1) AMP_A.B17(VDD2) AMP_A.B18(VDD3) AMP_A.B21(LVDS_EN) AMP_B.B2(VESD) AMP_B.B4(VDD1) AMP_B.B17(VDD2) AMP_B.B18(VDD3) AMP_B.B21(LVDS_EN) C2.1 C3.1 C8.1 DIO_TEA.10 U1.VS1 U1.VS2 U2.16(VCC) VCC1.1 VCC2.1
VCC_THRU: DTHRU_BNA.10 DTHRU_TNA.10
XOUT1: C4.2 R8.2 U1.XOUT
YOUT1: C5.2 R9.2 U1.YOUT
ZOUT1: C6.2 R10.2 U1.ZOUT
Unconnected: AMP_A.A(REF_ELEC1) AMP_A.B20(AUXOUT) AMP_A.B(REF_ELEC2) AMP_B.A(REF_ELEC1) AMP_B.B(REF_ELEC2) MECH_TNB.1 MECH_TNB.2 MECH_TNB.3 MECH_TNB.4 MECH_TNB.5 MECH_TNB.6 MECH_TNB.7 MECH_TNB.8 MECH_TNB.9 MECH_TNB.10 MECH_TNB.11 MECH_TNB.12 MECH_TNB.13 MECH_TNB.14 MECH_TNB.15 MECH_TNB.16 MECH_TNB.17 MECH_TNB.18 MECH_TNB.19 MECH_TNB.20 MECH_TNB.21 MECH_TNB.22 MECH_TNB.23 MECH_TNB.24 MECH_TNB.25 MECH_TNB.26 MECH_TNB.27 MECH_TNB.28 MECH_TNB.29 MECH_TNB.30 MECH_TNB.31 MECH_TNB.32 MECH_TNB.33 MECH_TNB.34 MECH_TNB.35 MECH_TNB.36 MECH_TNB.37 MECH_TNB.38 MECH_TNB.39 MECH_TNB.40 MECH_TNB.41 MECH_TNB.42 MECH_TNB.43 MECH_TNB.44 MECH_TNB.45 MECH_TNB.46 MECH_TNB.47 MECH_TNB.48 MECH_TNB.49 MECH_TNB.50 MECH_TNB.51 MECH_TNB.52 MECH_TNB.53 MECH_TNB.54 MECH_TNB.55 MECH_TNB.56 MECH_TNB.57 MECH_TNB.58 MECH_TNB.59 MECH_TNB.60 MECH_TNB.61 MECH_TNB.62 MECH_TNB.63 MECH_TNB.64 MECH_TNB.65 MECH_TNB.66 MECH_TNB.67 MECH_TNB.68 MECH_TNB.69 MECH_TNB.70 MECH_TSB.1 MECH_TSB.2 MECH_TSB.3 MECH_TSB.4 MECH_TSB.5 MECH_TSB.6 MECH_TSB.7 MECH_TSB.8 MECH_TSB.9 MECH_TSB.10 MECH_TSB.11 MECH_TSB.12 MECH_TSB.13 MECH_TSB.14 MECH_TSB.15 MECH_TSB.16 MECH_TSB.17 MECH_TSB.18 MECH_TSB.19 MECH_TSB.20 MECH_TSB.21 MECH_TSB.22 MECH_TSB.23 MECH_TSB.24 MECH_TSB.25 MECH_TSB.26 MECH_TSB.27 MECH_TSB.28 MECH_TSB.29 MECH_TSB.30 MECH_TSB.31 MECH_TSB.32 MECH_TSB.33 MECH_TSB.34 MECH_TSB.35 MECH_TSB.36 MECH_TSB.37 MECH_TSB.38 MECH_TSB.39 MECH_TSB.40 MECH_TSB.41 MECH_TSB.42 MECH_TSB.43 MECH_TSB.44 MECH_TSB.45 MECH_TSB.46 MECH_TSB.47 MECH_TSB.48 MECH_TSB.49 MECH_TSB.50 MECH_TSB.51 MECH_TSB.52 MECH_TSB.53 MECH_TSB.54 MECH_TSB.55 MECH_TSB.56 MECH_TSB.57 MECH_TSB.58 MECH_TSB.59 MECH_TSB.60 MECH_TSB.61 MECH_TSB.62 MECH_TSB.63 MECH_TSB.64 MECH_TSB.65 MECH_TSB.66 MECH_TSB.67 MECH_TSB.68 MECH_TSB.69 MECH_TSB.70 U1.NC3 U1.NC4 U1.NC5 U2.2(2Y0) U2.12(1Y0)

## Notes on the sheet
- A/D CONVERSION | PASS THROUGH
- ACCELEROMETER
- Solderable Pins
- Solderable Pins
- AUXIN's should be jumpered if you want to be compatiable with old headstages
- MECHANICAL | ELECTROPLATING | TEST POINTS
- Pull-down nominal states:
  S1: ELEC_TEST1 --> OPEN
  S2: ELEC_TEST2 --> OPEN
  S3: REF --> GND (if R4 is in place)

## Library data of the parts
A1-A3 B1-B3 BOUT GND GND. REF1 REF2 VCC1 VCC2 = jonnew:TESTPOINT: PCB Test Point
AIN_BNB AIN_BSB ATHRU_BEB ATHRU_BWB ATHRU_TEB ATHRU_TWB MECH_TNB MECH_TSB = jonnew:PINHD-2X35
AMP_A AMP_B = jonnew:RHD2164: Intan Technologies RHD2164 chip
C1 C2 C7 C8 = RHD2000_eval_board:C: Capacitor
C3 = headstage:C: Capacitor
C4-C6 = jonnew:C: Capacitor
DIO_TEA DTHRU_BNA DTHRU_TNA = jonnew:PINHD-2X10
PLATE = jonnew:OMNETICS_PZN-06
R1-R3 R8-R10 = jonnew:R: Resistor
R4-R7 = RHD2000_eval_board:R: Resistor
U1 = jonnew:ADXL335: The ADXL335 is a small, thin, low power, complete 3-axis accelerometer with signal conditioned voltage outputs. The product measures acceleration with a minimum full-scale range of ±3 g. It can measure the static acceleration of gravity in tilt-sensing applications, as well as dynamic acceleration resulting from motion, shock, or vibration. The user selects the bandwidth of the accelerometer using the CX, CY, and CZ capacitors at the XOUT, YOUT, and ZOUT pins. Bandwidths can be selected to suit the application, with a range of 0.5 Hz to 1600 Hz for the X and Y axes, and a range of 0.5 Hz to 550 Hz for the Z axi
U2 = jonnew:74HC4053

## Net classes
1 thick: width 0.102 mm